# EasyEDA Pro project ProPrj_nrf52833_LighthouseTag_2025-07-23.epro

# Schematic Schematic4
Create Date: 2025-05-14; Page Name: P1; Project Name: Magnetic robot_hkust_bi; Schematic Name: Schematic4; Update Date: 2025-05-18
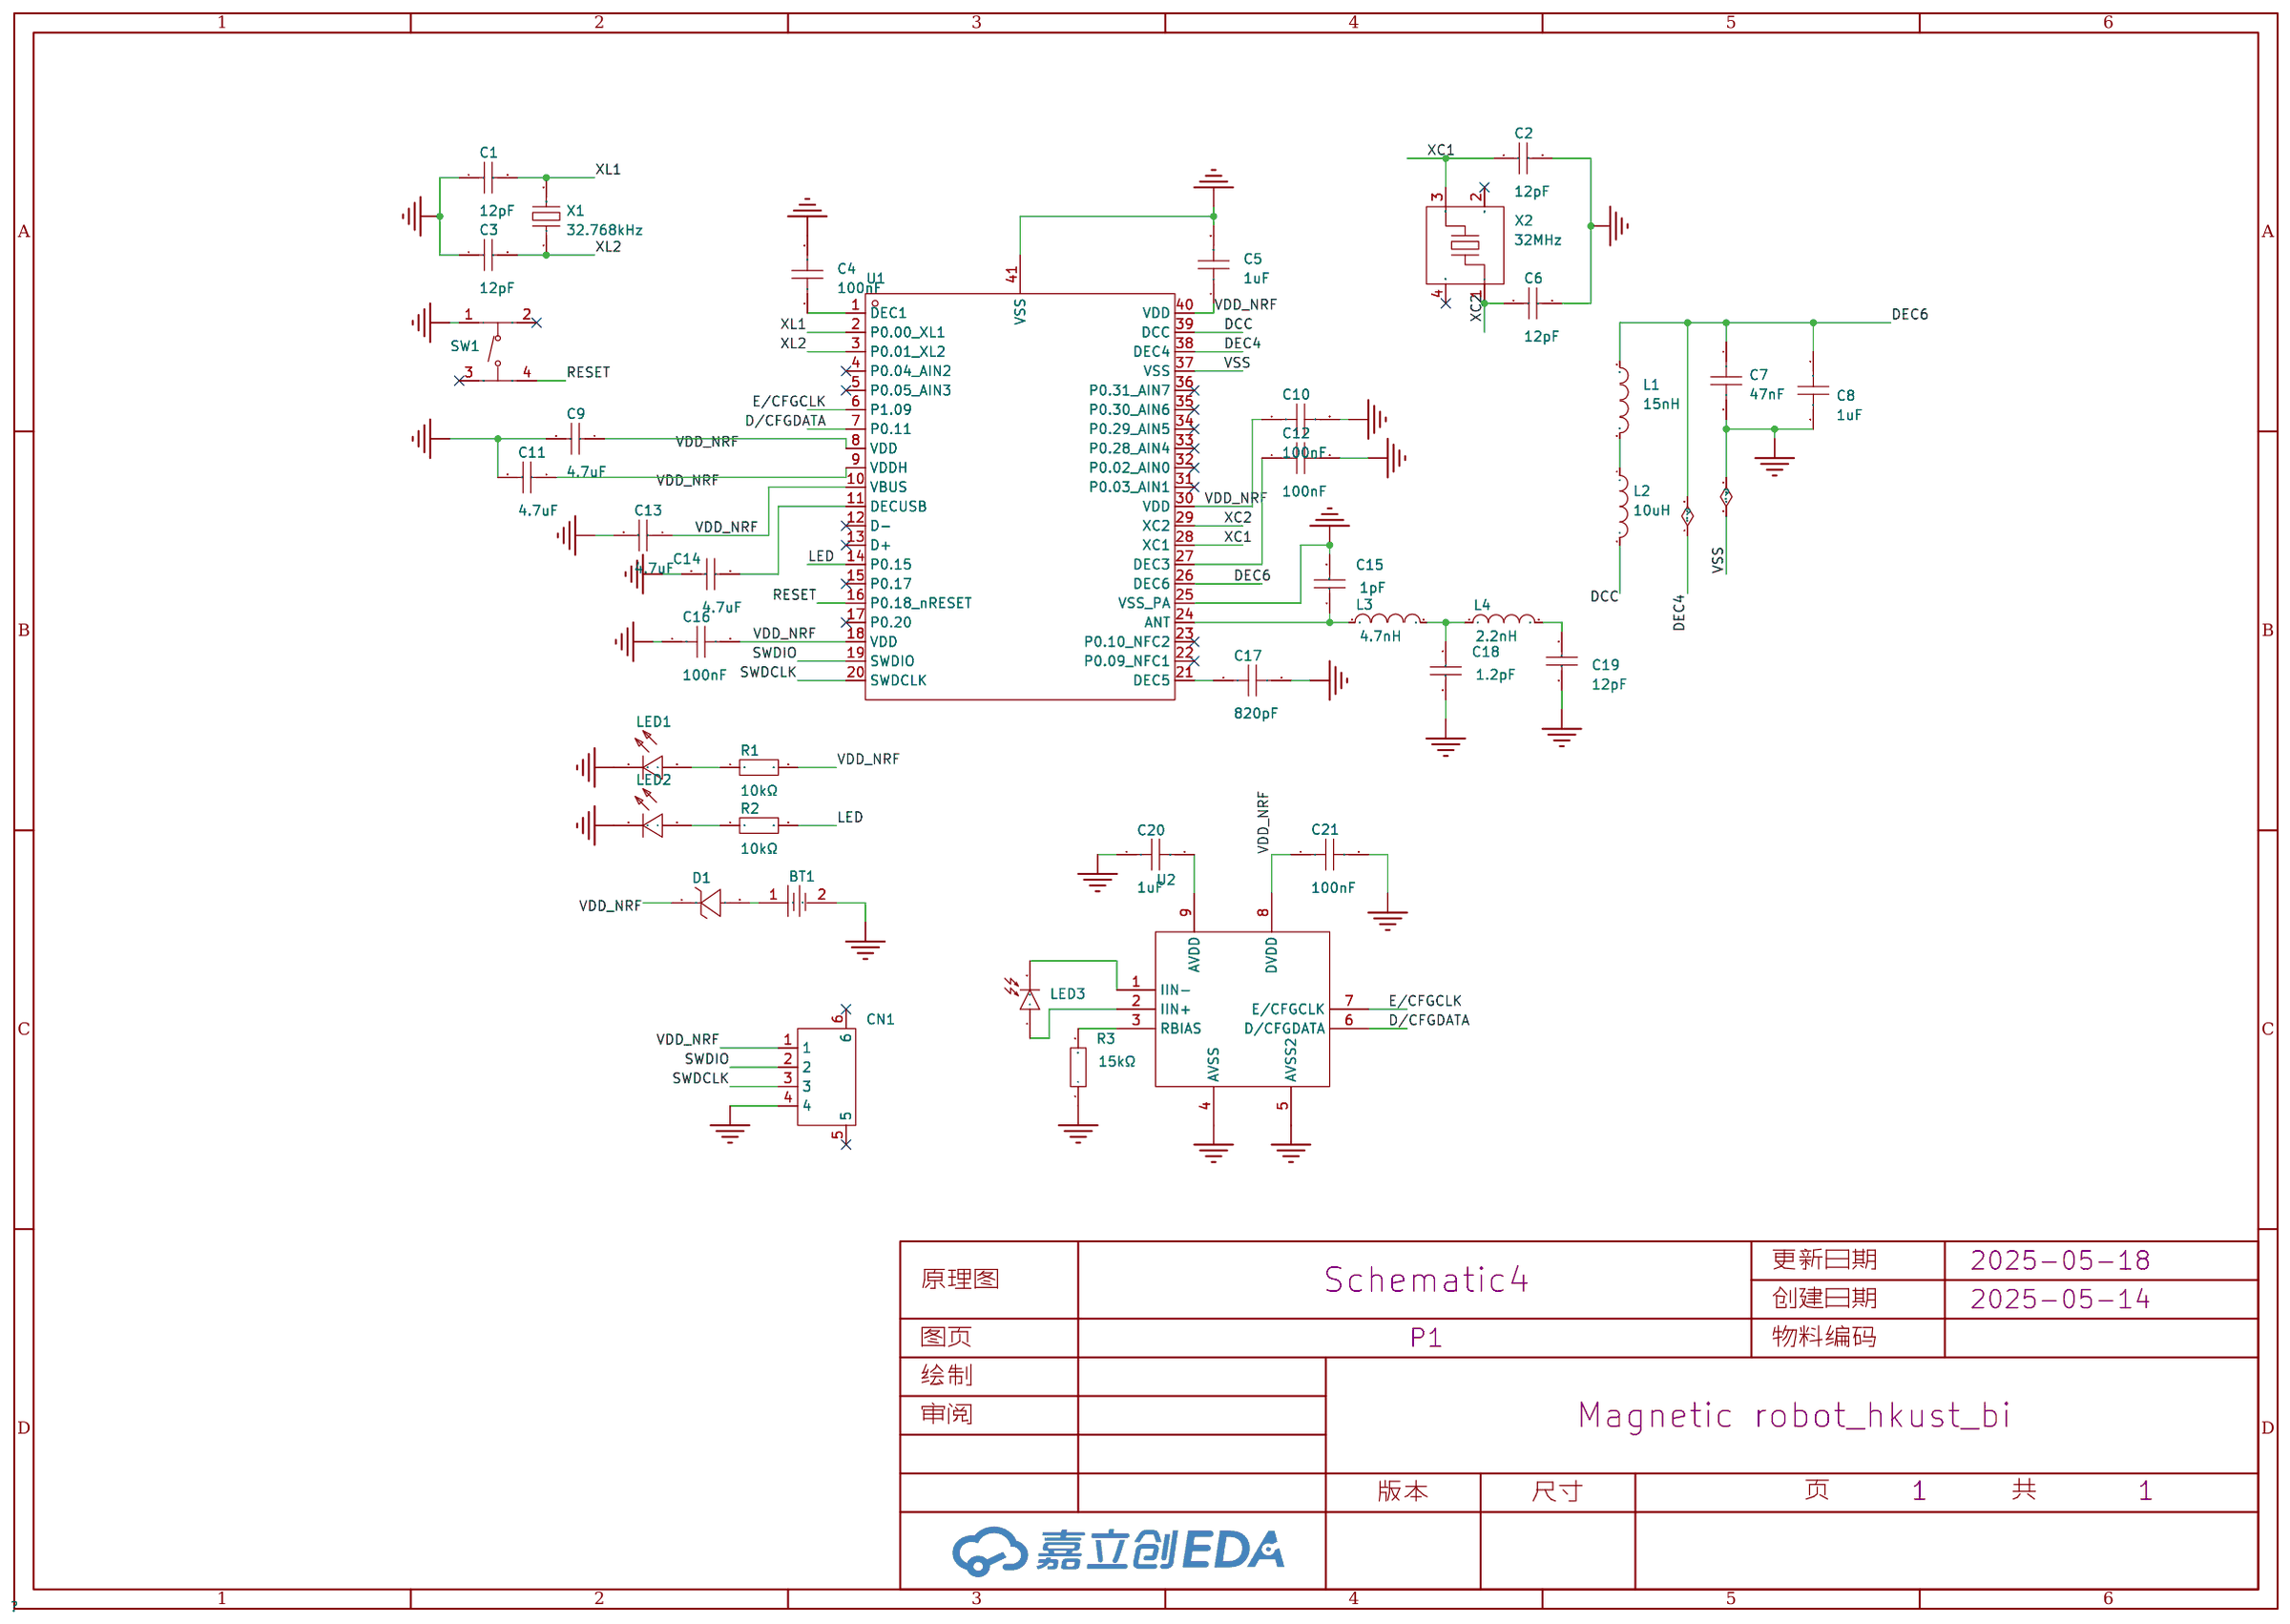
[diagram p0: schematic sheet]

## Parts
BT1  MY-927-01  [BAT-TH_MY-927-01]
C1  12pF  [C0402]
C2  12pF  [C0402]
C3  12pF  [C0402]
C4  100nF  [C0402]
C5  1uF  [C0402]
C6  12pF  [C0402]
C7  47nF  [C0402]
C8  1uF  [C0402]
C9  4.7uF  [C0402]
C10  100nF  [C0402]
C11  4.7uF  [C0402]
C12  100nF  [C0402]
C13  4.7uF  [C0402]
C14  4.7uF  [C0402]
C15  1pF  [C0402]
C16  100nF  [C0402]
C17  820pF  [C0402]
C18  1.2pF  [C0402]
C19  12pF  [C0402]
C20  1uF  [C0402]
C21  100nF  [C0402]
CN1  1.0-4PWB  [CONN-SMD_4P-P1.00_DEALON_1.0-4PWB]
D1  BZT52C3V3S  [SOD-323_L1.7-W1.3-LS2.6-RD]
L1  15nH  [IND-SMD_L1.0-W0.5-2]
L2  10uH  [IND-SMD_L2.5-W2.0]
L3  4.7nH  [IND-SMD_L1.0-W0.6]
L4  2.2nH  [IND-SMD_L1.0-W0.6]
LED1  NCD0603G1  [LED0603-RD_1]
LED2  NCD0603G1  [LED0603-RD_1]
LED3  VBPW34S  [SENSOR-SMD_L4.4-W3.9]
R1  10kΩ  [R0402]
R2  10kΩ  [R0402]
R3  15kΩ  [R0402]
SW1  TS-1187A-B-A-B  [SW-SMD_4P-L5.1-W5.1-P3.70-LS6.5-TL_H1.5]
U1  nRF52833-QDAA-R  [QFN-40_L5.0-W5.0-P0.40-TL-EP3.6]
U2  -  [TS4231]
X1  32.768kHz  [OSC-SMD_L3.2-W1.5]
X2  32MHz  [CRYSTAL-SMD_4P-L2.0-W1.6-BL-2]

## Library data of the parts
BT1 = MY-927-01: 连接器类型:电池扣;适用电池规格:CR927;触头材质:锰钢;触点电镀:镍;工作温度范围:-25~+85;; LCSC Part Name: 电池扣 适用电池:CR927; Supplier Part: C964850; Manufacturer: MYOUNG(美阳); Supplier Footprint: 插件; JLCPCB Part Class: Extended Part; Datasheet: https://atta.szlcsc.com/upload/public/pdf/source/20201218/C964850_48FDFDE1A9A12212C9EC07C1F9ECA79B.pdf; Supplier: LCSC; Connector Type: 电池扣; Battery Type: CR927; Contact Material: 锰钢; Contact Plating: 镍; Operating Temperature Range: -25~+85
C1-C3 C6 C19 = GRM1555C1H120JA01D: 容值:12pF;精度:±5%;额定电压:50V;温度系数:C0G;; LCSC Part Name: 12pF ±5% 50V; Supplier Part: C76948; Manufacturer: muRata(村田); Supplier Footprint: 0402; JLCPCB Part Class: Extended Part; Datasheet: https://atta.szlcsc.com/upload/public/pdf/source/20180307/C76948_15204091175261407736.pdf; Supplier: LCSC; Tolerance: ±5%; Voltage Rating: 50V; Temperature Coefficient: C0G
C4 C10 C12 C16 C21 = CL05B104KB54PNC: 容值:100nF;精度:±10%;额定电压:50V;材质(温度系数):X7R;; LCSC Part Name: 100nF ±10% 50V; Supplier Part: C307331; Manufacturer: SAMSUNG(三星); Supplier Footprint: 0402; JLCPCB Part Class: Basic Part; Datasheet: https://atta.szlcsc.com/upload/public/pdf/source/20160218/1457707763339.pdf; Supplier: LCSC; Tolerance: ±10%; Voltage Rated: 50V; Temperature Coefficient: X7R
C5 C8 C20 = CL05A105KA5NQNC: 容值:1uF;精度:±10%;额定电压:25V;材质(温度系数):X5R;; LCSC Part Name: 1uF ±10% 25V; Supplier Part: C52923; Manufacturer: SAMSUNG(三星); Supplier Footprint: 0402; JLCPCB Part Class: Basic Part; Datasheet: https://atta.szlcsc.com/upload/public/pdf/source/20160218/1457707763339.pdf; Supplier: LCSC; Tolerance: ±10%; Voltage Rated: 25V; Temperature Coefficient: X5R
C7 = CC0402KRX7R9BB473: 容值:47nF;精度:±10%;额定电压:50V;材质(温度系数):X7R;; LCSC Part Name: 47nF ±10% 50V; Supplier Part: C272875; Manufacturer: YAGEO(国巨); Supplier Footprint: 0402; JLCPCB Part Class: Extended Part; Datasheet: https://atta.szlcsc.com/upload/public/pdf/source/20181008/C309510_22F155564471FAF6A489F7D68F34234E.pdf; Supplier: LCSC; Tolerance: ±10%; Voltage Rated: 50V; Temperature Coefficient: X7R
C9 C11 C13 C14 = CL05A475MP5NRNC: 容值:4.7uF;精度:±20%;额定电压:10V;材质(温度系数):X5R;; LCSC Part Name: 4.7uF ±20% 10V; Supplier Part: C23733; Manufacturer: SAMSUNG(三星); Supplier Footprint: 0402; JLCPCB Part Class: Basic Part; Datasheet: https://atta.szlcsc.com/upload/public/pdf/source/20160218/1457707763339.pdf; Supplier: LCSC; Tolerance: ±20%; Voltage Rated: 10V; Temperature Coefficient: X5R
C15 = GJM1555C1H1R0WB01D: 容值:1pF;额定电压:50V;材质(温度系数):C0G;; LCSC Part Name: 1pF 50V ±0.05pF; Supplier Part: C72134; Manufacturer: muRata(村田); Supplier Footprint: 0402; JLCPCB Part Class: Extended Part; Datasheet: https://atta.szlcsc.com/upload/public/pdf/source/20161108/1478586454732.pdf; Supplier: LCSC; Voltage Rated: 50V; Temperature Coefficient: C0G
C17 = CC0402KRX7R9BB821: 容值:820pF;精度:±10%;额定电压:50V;材质(温度系数):X7R;; LCSC Part Name: 820pF ±10% 50V; Supplier Part: C107031; Manufacturer: YAGEO(国巨); Supplier Footprint: 0402; JLCPCB Part Class: Extended Part; Datasheet: https://atta.szlcsc.com/upload/public/pdf/source/20200803/C107031_D53C25CCCFEE93078DE0825CA32986C0.pdf; Supplier: LCSC; Tolerance: ±10%; Voltage Rated: 50V; Temperature Coefficient: X7R
C18 = GJM1555C1H1R2WB01D: 容值:1.2pF;额定电压:50V;材质(温度系数):C0G;; LCSC Part Name: 1.2pF 50V; Supplier Part: C76899; Manufacturer: muRata(村田); Supplier Footprint: 0402; JLCPCB Part Class: Extended Part; Datasheet: https://atta.szlcsc.com/upload/public/pdf/source/20180326/C76899_D46909C5BA6C0CCEF2691B3FE0C3732C.pdf; Supplier: LCSC; Voltage Rated: 50V; Temperature Coefficient: C0G
CN1 = 1.0-4PWB: 插针结构:1x4P;间距:1mm;安装方式:卧贴;参考系列:SH;总PIN数:4P;排数:1;每排PIN数:4;行距:-;额定电流:1A;触头材质:-;触头镀层:-;工作温度:-25~+85;; LCSC Part Name: 1x4P 间距:1mm 卧贴 系列:SH; Supplier Part: C2905006; Manufacturer: DEALON(德艺隆); Supplier Footprint: SMD,P=1mm,卧贴; JLCPCB Part Class: Extended Part; Datasheet: https://atta.szlcsc.com/upload/public/pdf/source/20211108/FAA45F8836A30651AE08A2D9A2D823F3.pdf; Supplier: LCSC; Pins Structure: 1x4P; Pitch: 1mm; Mounting Type: 卧贴; Reference Series: SH; Number of Pins: 4P; Number of Rows: 1; Number of PINs Per Row: 4; Current Rating: 1A; Operating Temperature: -25~+85; Voltage Rating: 50V; Supplementary Features: 辅助焊脚; Color: 米色; Z-Height of the Board: 2.9mm; X-Length of Bottom Edge on Board (Spacing Line): 6mm; Y-Width of Bottom Edge on Board: 5.03mm
D1 = BZT52C3V3S_C19077437: 二极管配置:独立式;稳压值(标称值):3.3V;稳压值(范围):3.1V~3.5V;功率(Pd):200mW;; Supplier Part: C19077437; Manufacturer: 宏迦橙; Supplier Footprint: SOD-323; JLCPCB Part Class: Extended Part; Datasheet: https://atta.szlcsc.com/upload/public/pdf/source/20231117/06CD1C2A69B3FFC97FEAE4263E1B2FE9.pdf; Supplier: LCSC; Diode Configuration: 独立式; Zener Voltage (Nom): 3.3V; Reverse Leakage Current (Ir): 5uA@1V; Zener Voltage (Range): 3.1V~3.5V; Power Dissipation: 200mW; Zener Impedance (Zzt): 95Ω
L1 = LQW15AN15NG00D: 电感值:15nH;精度:±2%;额定电流:460mA;饱和电流(Isat):-;; LCSC Part Name: 15nH ±2%; Supplier Part: C98055; Manufacturer: muRata(村田); Supplier Footprint: 0402; JLCPCB Part Class: Extended Part; Datasheet: https://atta.szlcsc.com/upload/public/pdf/source/20191016/C437364_463D6516B3BAE72B1DA0754F3D9B8308.pdf; Supplier: LCSC; Tolerance: ±2%; Rated Current: 460mA; DC Resistance (DCR): 160mΩ
L2 = FTC252012S100MBCA: 电感值:10uH;精度:±20%;额定电流:1.2A;饱和电流(Isat):1.6A;类型:一体成型电感;; LCSC Part Name: 10uH ±20% 1.6A; Supplier Part: C5832376; Manufacturer: cjiang(长江微电); Supplier Footprint: SMD,2x2.5mm; JLCPCB Part Class: Extended Part; Datasheet: https://atta.szlcsc.com/upload/public/pdf/source/20230602/8FFEDA9C0247A92A0D4B67554BFE4091.pdf; Supplier: LCSC; Tolerance: ±20%; Rated Current: 1.2A; Saturation Current (Isat): 1.6A; DC Resistance (DCR): 330mΩ; Type: 一体成型电感
L3 = LQW15AN4N7B00D: 电感值:4.7nH;额定电流:750mA;饱和电流(Isat):-;; Supplier Part: C98064; Manufacturer: muRata(村田); Supplier Footprint: 0402; JLCPCB Part Class: Extended Part; Datasheet: https://atta.szlcsc.com/upload/public/pdf/source/20191016/C437364_463D6516B3BAE72B1DA0754F3D9B8308.pdf; Supplier: LCSC; Rated Current: 750mA; DC Resistance (DCR): 70mΩ
L4 = LQW15AN2N2B80D: 电感值:2.2nH;额定电流:2.53A;饱和电流(Isat):-;; Supplier Part: C2041833; Manufacturer: muRata(村田); Supplier Footprint: 0402; JLCPCB Part Class: Extended Part; Datasheet: https://atta.szlcsc.com/upload/public/pdf/source/20210504/828CF85BF1F050871A8563B8C7472C90.pdf; Supplier: LCSC; Rated Current: 2.53A; DC Resistance (DCR): 22mΩ
LED1 LED2 = NCD0603G1: 发光颜色:翠绿色;正向压降(Vf):2.6V~3.6V;功率:72mW;正向电流:20mA;波长:515nm~530nm;透镜颜色:-;发光强度:330mcd~900mcd;发光角度:130°;工作温度:-30~+85;; Supplier Part: C84267; Manufacturer: 国星光电; Supplier Footprint: 0603; JLCPCB Part Class: Extended Part; Datasheet: https://atta.szlcsc.com/upload/public/pdf/source/20200820/C84267_04BA7703640BAC111D09F5EFB971FBF3.pdf; Supplier: LCSC; Illumination Color: 翠绿色; Voltage - Forward(Vf): 2.6V~3.6V; Power(Watts): 72mW; Forward Current: 20mA; Wavelength - Dominant: 515nm~530nm; Luminous Intensity: 330mcd~900mcd; Viewing Angle: 130°; Operating Temperature: -30~+85
LED3 = VBPW34S: 反向电压:60V;接收角:-;峰值波长:940nm;频谱范围:430nm~1100nm;暗电流:2nA;; LCSC Part Name: 940nm 频谱范围430nm~1100nm 反向电压60V; Supplier Part: C145262; Manufacturer: VISHAY(威世); Supplier Footprint: SMD,3.9x4.4mm; JLCPCB Part Class: Extended Part; Datasheet: https://atta.szlcsc.com/upload/public/pdf/source/20171211/C145262_15129614507721174601.pdf; Supplier: LCSC; DC Reverse Voltage: 60V; Peak  Wavelength: 940nm; Spectral Range: 430nm~1100nm; Current Dark: 2nA; Operating Temperature: -40~+100
R1 R2 = 0402WGF1002TCE: 电阻类型:厚膜电阻;阻值:10kΩ;精度:±1%;功率:62.5mW;最大工作电压:50V;温度系数:±100ppm/;; LCSC Part Name: 10kΩ ±1% 62.5mW 厚膜电阻; Supplier Part: C25744; Manufacturer: UNI-ROYAL(厚声); Supplier Footprint: 0402; JLCPCB Part Class: Basic Part; Datasheet: https://atta.szlcsc.com/upload/public/pdf/source/20200306/C422600_1E6D84923E4A46A82E41ADD87F860B5C.pdf; Supplier: LCSC; Type: 厚膜电阻; Tolerance: ±1%; Power(Watts): 62.5mW; Overload Voltage (Max): 50V; Temperature Coefficient: ±100ppm/; Operating Temperature Range: -55~+155
R3 = 0402WGF1502TCE: 电阻类型:厚膜电阻;阻值:15kΩ;精度:±1%;功率:62.5mW;最大工作电压:50V;温度系数:±100ppm/;; LCSC Part Name: 15kΩ ±1% 62.5mW 厚膜电阻; Supplier Part: C25756; Manufacturer: UNI-ROYAL(厚声); Supplier Footprint: 0402; JLCPCB Part Class: Basic Part; Datasheet: https://atta.szlcsc.com/upload/public/pdf/source/20200306/C422600_1E6D84923E4A46A82E41ADD87F860B5C.pdf; Supplier: LCSC; Type: 厚膜电阻; Tolerance: ±1%; Power(Watts): 62.5mW; Overload Voltage (Max): 50V; Temperature Coefficient: ±100ppm/; Operating Temperature Range: -55~+155
SW1 = TS-1187A-B-A-B: 电路结构:单刀单掷;按钮形状:圆形按钮;作用力:160gf;安装方式:立贴;开关长度:5.1mm;开关宽度:5.1mm;开关高度:1.5mm;带支架:不带;触点电流:50mA;额定电压(DC):12V;绝缘电阻:-;带灯:无;机械寿命:10万次;; LCSC Part Name: 5.1*5.1*1.5mm 立贴 轻触开关; Supplier Part: C318884; Manufacturer: XKB Connectivity(中国星坤); Supplier Footprint: SMD; JLCPCB Part Class: Basic Part; Datasheet: https://atta.szlcsc.com/upload/public/pdf/source/20200227/C318890_053E50208A88A7BA1965D8746000774E.pdf; Supplier: LCSC; Circuit: 单刀单掷; Actuator Style: 圆形按钮; Operating Force: 160gf; Mounting Style: 立贴; Switch Length: 5.1mm; Switch Width: 5.1mm; Switch Height: 1.5mm; Strike Gundam: 不带; Contact Current: 50mA; Voltage Rating (DC): 12V; Actuator/Cap Color: 金色; With Lamp: 无; Mechanical Life: 10万次; Operating Temperature: -30~+85
U1 = nRF52833-QDAA-R: Supplier Part: C2895249; Manufacturer: NORDIC; Supplier Footprint: QFN-40-EP(5x5); JLCPCB Part Class: Extended Part; Datasheet: https://atta.szlcsc.com/upload/public/pdf/source/20220526/66538D94E2BF566AD23AAE4CF6584247.pdf; Supplier: LCSC
U2 = TS4231
X1 = X321532768KGD2SI: 晶振类型:贴片晶振;频率:32.768kHz;常温频差:±20ppm;外接负载电容:12.5pF;频率稳定度(全温):-;; LCSC Part Name: 32.768kHz ±20ppm 12.5pF; Supplier Part: C620155; Manufacturer: YXC(扬兴晶振); Supplier Footprint: SMD3215-2P; JLCPCB Part Class: Extended Part; Datasheet: https://atta.szlcsc.com/upload/public/pdf/source/20240329/3A7650FD985DD0DE85694D3785AB4916.pdf; Supplier: LCSC; Crystal Type: 贴片晶振; Normal temperature Frequency Tolerance: ±20ppm; External load capacitor: 12.5pF; Operating Temperature: -40~+85
X2 = X201632MOB4SI: 晶振类型:贴片晶振;频率:32MHz;常温频差:±10ppm;负载电容:12pF;频率稳定度:±20ppm;; LCSC Part Name: 32MHz ±10ppm 12pF; Supplier Part: C2682773; Manufacturer: YXC(扬兴晶振); Supplier Footprint: SMD2016-4P; JLCPCB Part Class: Extended Part; Datasheet: https://atta.szlcsc.com/upload/public/pdf/source/20240329/C26C9A15A73CBCFBF373B30A8E126750.pdf; Supplier: LCSC; Type: 贴片晶振; Normal temperature Frequency Tolerance: ±10ppm; Load Capacitance: 12pF; Frequency Stability: ±20ppm; Operating Temperature: -40~+85

## Nets
GND: BT1.2 C1.1 C2.2 C3.1 C4.2 C5.2 C6.2 C7.2 C8.2 C9.2 C10.2 C11.2 C12.2 C13.2 C14.1 C15.2 C16.1 C17.2 C18.1 C19.1 C20.1 C21.2 CN1.4 LED1.1(K) LED2.1(K) R3.1 SW1.1(A) U1.25(VSS_PA) U1.37(VSS) U1.41(VSS) U2.4(AVSS) U2.5(AVSS2)
VDD_NRF: C5.1 C9.1 C10.1 C11.1 C13.1 C16.2 C21.1 CN1.1 D1.1(K) R1.2 U1.8(VDD) U1.9(VDDH) U1.10(VBUS) U1.18(VDD) U1.30(VDD) U1.40(VDD) U2.8(DVDD)
D/CFGDATA: U1.7(P0.11) U2.6(D/CFGDATA)
DCC: L2.2 U1.39(DCC)
DEC4: C7.1 C8.1 L1.2 U1.26(DEC6) U1.38(DEC4)
E/CFGCLK: U1.6(P1.09) U2.7(E/CFGCLK)
LED: R2.2 U1.14(P0.15)
RESET: SW1.4(D) U1.16(P0.18_nRESET)
SWDCLK: CN1.3 U1.20(SWDCLK)
SWDIO: CN1.2 U1.19(SWDIO)
XC1: C2.1 U1.28(XC1) X2.3
XC2: C6.1 U1.29(XC2) X2.1
XL1: C1.2 U1.2(P0.00_XL1) X1.2
XL2: C3.2 U1.3(P0.01_XL2) X1.1
$1N1552: C14.2 U1.11(DECUSB)
$1N2289: C17.1 U1.21(DEC5)
$1N2530: C15.1 L3.1 U1.24(ANT)
$1N2985: C18.2 L3.2 L4.1
$1N3242: C19.2 L4.2
$1N3495: C12.1 U1.27(DEC3)
$1N6091: L1.1 L2.1
$1N9430: C20.2 U2.9(AVDD)
$1N11204: LED3.2(C) U2.1(IIN-)
$1N11226: LED3.1(A) U2.2(IIN+)
$1N11357: R3.2 U2.3(RBIAS)
$1N20837: BT1.1 D1.2(A)
$1N22902: LED2.2(A) R2.1
$1N23087: C4.1 U1.1(DEC1)
$1N23686: LED1.2(A) R1.1

Not connected (* = marked no-connect by the designer): CN1 5* 6*; SW1 2(B)* 3(C)*; U1 4(P0.04_AIN2)* 5(P0.05_AIN3)* 12(D-)* 13(D+)* 15(P0.17)* 17(P0.20)* 22(P0.09_NFC1)* 23(P0.10_NFC2)* 31(P0.03_AIN1)* 32(P0.02_AIN0)* 33(P0.28_AIN4)* 34(P0.29_AIN5)* 35(P0.30_AIN6)* 36(P0.31_AIN7)*; X2 2(GND)* 4(GND)*

# Schematic Schematic4_1
Board Name: Positioning tag; Create Date: 2025-06-04; Page Name: P1; Project Name: Magnetic robot_hkust_bi; Schematic Name: Schematic4; Update Date: 2025-07-18; Company: 嘉立创EDA; Page Size: A4; Version: V1.0
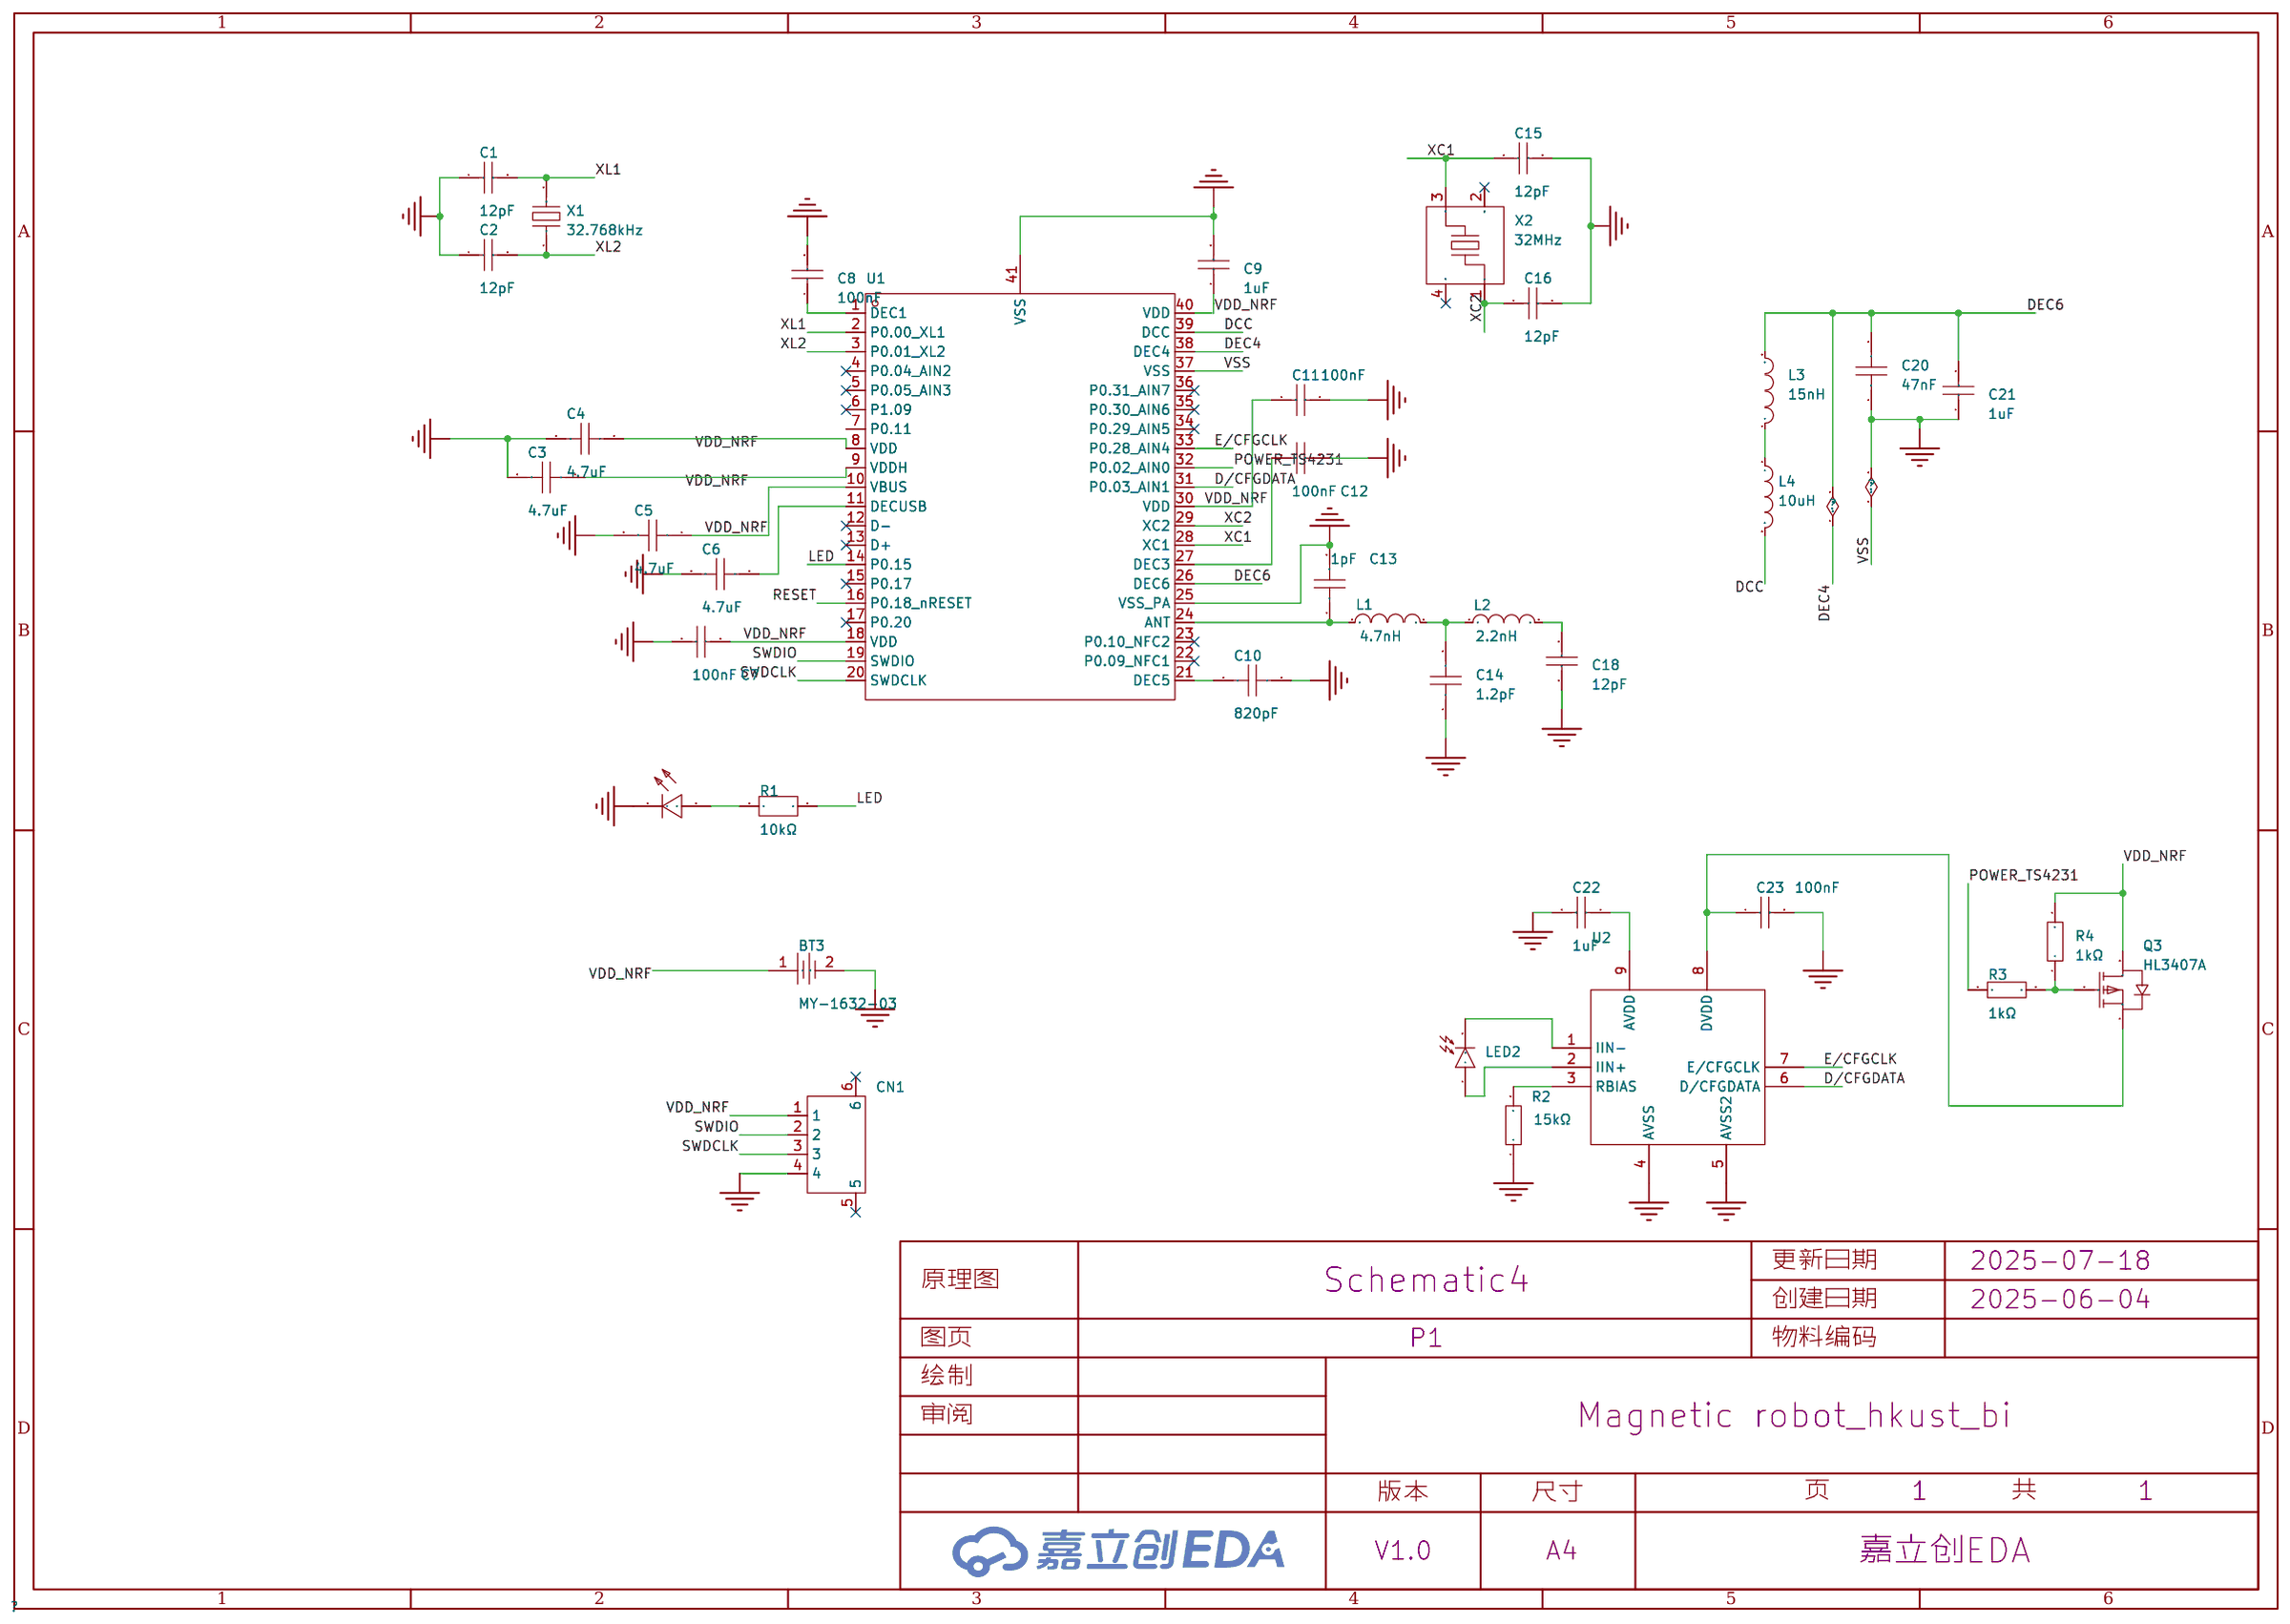
[diagram p1: schematic sheet]

## Parts
BT3  MY-1632-03  [BAT-SMD_MY-1632-03]
C1  12pF  [C0402]
C2  12pF  [C0402]
C3  4.7uF  [C0201]
C4  4.7uF  [C0201]
C5  4.7uF  [C0201]
C6  4.7uF  [C0201]
C7  100nF  [C0201]
C8  100nF  [C0201]
C9  1uF  [C0201]
C10  820pF  [C0402]
C11  100nF  [C0201]
C12  100nF  [C0201]
C13  1pF  [C0201]
C14  1.2pF  [C0201]
C15  12pF  [C0402]
C16  12pF  [C0402]
C18  12pF  [C0402]
C20  47nF  [C0201]
C21  1uF  [C0201]
C22  1uF  [C0201]
C23  100nF  [C0201]
CN1  1.0-4PWB  [CONN-SMD_4P-P1.00_DEALON_1.0-4PWB]
L1  4.7nH  [IND-SMD_L1.0-W0.6]
L2  2.2nH  [IND-SMD_L1.0-W0.6]
L3  15nH  [IND-SMD_L1.0-W0.5-2]
L4  10uH  [IND-SMD_L2.5-W2.0]
LED1  NCD0603G1  [LED0603-RD_1]
LED2  VBPW34S  [SENSOR-SMD_L4.4-W3.9]
Q3  HL3407A  [SOT-23-3_L2.9-W1.3-P1.90-LS2.4-BL-1]
R1  10kΩ  [R0201]
R2  15kΩ  [R0402]
R3  1kΩ  [R0201]
R4  1kΩ  [R0201]
U1  nRF52833-QDAA-R  [QFN-40_L5.0-W5.0-P0.40-TL-EP3.6]
U2  -  [TS4231]
X1  32.768kHz  [OSC-SMD_L3.2-W1.5]
X2  32MHz  [CRYSTAL-SMD_4P-L2.0-W1.6-BL-2]

## Library data of the parts
BT3 = MY-1632-03: 连接器类型:电池扣;适用电池规格:CR1632;触头材质:磷青铜;触点电镀:镍;工作温度范围:-;; LCSC Part Name: 电池扣 适用电池:CR1632; Supplier Part: C2902337; Manufacturer: MYOUNG(美阳); Supplier Footprint: SMD; JLCPCB Part Class: 扩展库; Datasheet: https://atta.szlcsc.com/upload/public/pdf/source/20210930/472CF4FBD9839664A13EAEB041674A4D.pdf; Supplier: LCSC; Connector Type: 电池扣; Battery Type: CR1632; Contact Material: 磷青铜; Contact Plating: 镍
C1 C2 C15 C16 C18 = GRM1555C1H120JA01D: 容值:12pF;精度:±5%;额定电压:50V;温度系数:C0G;; LCSC Part Name: 12pF ±5% 50V; Supplier Part: C76948; Manufacturer: muRata(村田); Supplier Footprint: 0402; JLCPCB Part Class: Extended Part; Datasheet: https://atta.szlcsc.com/upload/public/pdf/source/20180307/C76948_15204091175261407736.pdf; Supplier: LCSC; Tolerance: ±5%; Voltage Rating: 50V; Temperature Coefficient: C0G
C3-C6 = GRM035R60J475ME15D: 容值:4.7uF;精度:±20%;额定电压:6.3V;温度系数:X5R;; LCSC Part Name: 4.7uF ±20% 6.3V; Supplier Part: C335103; Manufacturer: muRata(村田); Supplier Footprint: 0201; JLCPCB Part Class: 扩展库; Datasheet: https://atta.szlcsc.com/upload/public/pdf/source/20200305/C490387_23319AE8C154DEB24C505E6C82A8106A.pdf; Supplier: LCSC; Tolerance: ±20%; Voltage Rating: 6.3V; Temperature Coefficient: X5R
C7 C8 C11 C12 C23 = GRM033R61E104KE14D: 容值:100nF;精度:±10%;额定电压:25V;温度系数:X5R;; LCSC Part Name: 100nF ±10% 25V; Supplier Part: C76939; Manufacturer: muRata(村田); Supplier Footprint: 0201; JLCPCB Part Class: 扩展库; Datasheet: https://atta.szlcsc.com/upload/public/pdf/source/20180307/C76939_15204091018551407727.pdf; Supplier: LCSC; Tolerance: ±10%; Voltage Rating: 25V; Temperature Coefficient: X5R
C9 C21 C22 = GRM033R61A105ME44D: 容值:1uF;精度:±20%;额定电压:10V;材质(温度系数):X5R;; LCSC Part Name: 1uF ±20% 10V; Supplier Part: C76935; Manufacturer: muRata(村田); Supplier Footprint: 0201; JLCPCB Part Class: 扩展库; Datasheet: https://atta.szlcsc.com/upload/public/pdf/source/20190904/C426118_85E81C7C1F21FC87C5FB6D536E0847B4.pdf; Supplier: LCSC; Tolerance: ±20%; Voltage Rated: 10V; Temperature Coefficient: X5R
C10 = CC0402KRX7R9BB821: 容值:820pF;精度:±10%;额定电压:50V;材质(温度系数):X7R;; LCSC Part Name: 820pF ±10% 50V; Supplier Part: C107031; Manufacturer: YAGEO(国巨); Supplier Footprint: 0402; JLCPCB Part Class: Extended Part; Datasheet: https://atta.szlcsc.com/upload/public/pdf/source/20200803/C107031_D53C25CCCFEE93078DE0825CA32986C0.pdf; Supplier: LCSC; Tolerance: ±10%; Voltage Rated: 50V; Temperature Coefficient: X7R
C13 = GRM0335C1H1R0BA01D: 容值:1pF;精度:-;额定电压:50V;温度系数:C0G;; LCSC Part Name: ±0.1pF 1pF 50V; Supplier Part: C85893; Manufacturer: muRata(村田); Supplier Footprint: 0201; JLCPCB Part Class: 扩展库; Datasheet: https://atta.szlcsc.com/upload/public/pdf/source/20200305/C490387_23319AE8C154DEB24C505E6C82A8106A.pdf; Supplier: LCSC; Voltage Rating: 50V; Temperature Coefficient: C0G
C14 = GRM0335C1H1R2BA01D: 容值:1.2pF;额定电压:50V;材质(温度系数):C0G;; LCSC Part Name: 1.2pF 50V; Supplier Part: C85895; Manufacturer: muRata(村田); Supplier Footprint: 0201; JLCPCB Part Class: 扩展库; Datasheet: https://atta.szlcsc.com/upload/public/pdf/source/20200305/C490387_23319AE8C154DEB24C505E6C82A8106A.pdf; Supplier: LCSC; Voltage Rated: 50V; Temperature Coefficient: C0G
C20 = CGA0201X5R473K160ET: 容值:47nF;精度:±10%;额定电压:16V;温度系数:X5R;; LCSC Part Name: 47nF ±10% 16V; Supplier Part: C45359887; Manufacturer: HRE(芯声); Supplier Footprint: 0201; JLCPCB Part Class: 扩展库; Datasheet: https://atta.szlcsc.com/upload/public/pdf/source/20250220/29719F0DB54B0A066ED9CF136703C3DF.pdf; Supplier: LCSC; Tolerance: ±10%; Voltage Rating: 16V; Temperature Coefficient: X5R
CN1 = 1.0-4PWB: 插针结构:1x4P;间距:1mm;安装方式:卧贴;参考系列:SH;总PIN数:4P;排数:1;每排PIN数:4;行距:-;额定电流:1A;触头材质:-;触头镀层:-;工作温度:-25~+85;; LCSC Part Name: 1x4P 间距:1mm 卧贴 系列:SH; Supplier Part: C2905006; Manufacturer: DEALON(德艺隆); Supplier Footprint: SMD,P=1mm,卧贴; JLCPCB Part Class: Extended Part; Datasheet: https://atta.szlcsc.com/upload/public/pdf/source/20211108/FAA45F8836A30651AE08A2D9A2D823F3.pdf; Supplier: LCSC; Pins Structure: 1x4P; Pitch: 1mm; Mounting Type: 卧贴; Reference Series: SH; Number of Pins: 4P; Number of Rows: 1; Number of PINs Per Row: 4; Current Rating: 1A; Operating Temperature: -25~+85; Voltage Rating: 50V; Supplementary Features: 辅助焊脚; Color: 米色; Z-Height of the Board: 2.9mm; X-Length of Bottom Edge on Board (Spacing Line): 6mm; Y-Width of Bottom Edge on Board: 5.03mm
L1 = LQW15AN4N7B00D: 电感值:4.7nH;额定电流:750mA;饱和电流(Isat):-;; Supplier Part: C98064; Manufacturer: muRata(村田); Supplier Footprint: 0402; JLCPCB Part Class: Extended Part; Datasheet: https://atta.szlcsc.com/upload/public/pdf/source/20191016/C437364_463D6516B3BAE72B1DA0754F3D9B8308.pdf; Supplier: LCSC; Rated Current: 750mA; DC Resistance (DCR): 70mΩ
L2 = LQW15AN2N2B80D: 电感值:2.2nH;额定电流:2.53A;饱和电流(Isat):-;; Supplier Part: C2041833; Manufacturer: muRata(村田); Supplier Footprint: 0402; JLCPCB Part Class: Extended Part; Datasheet: https://atta.szlcsc.com/upload/public/pdf/source/20210504/828CF85BF1F050871A8563B8C7472C90.pdf; Supplier: LCSC; Rated Current: 2.53A; DC Resistance (DCR): 22mΩ
L3 = LQW15AN15NG00D: 电感值:15nH;精度:±2%;额定电流:460mA;饱和电流(Isat):-;; LCSC Part Name: 15nH ±2%; Supplier Part: C98055; Manufacturer: muRata(村田); Supplier Footprint: 0402; JLCPCB Part Class: Extended Part; Datasheet: https://atta.szlcsc.com/upload/public/pdf/source/20191016/C437364_463D6516B3BAE72B1DA0754F3D9B8308.pdf; Supplier: LCSC; Tolerance: ±2%; Rated Current: 460mA; DC Resistance (DCR): 160mΩ
L4 = FTC252012S100MBCA: 电感值:10uH;精度:±20%;额定电流:1.2A;饱和电流(Isat):1.6A;类型:一体成型电感;; LCSC Part Name: 10uH ±20% 1.6A; Supplier Part: C5832376; Manufacturer: cjiang(长江微电); Supplier Footprint: SMD,2x2.5mm; JLCPCB Part Class: Extended Part; Datasheet: https://atta.szlcsc.com/upload/public/pdf/source/20230602/8FFEDA9C0247A92A0D4B67554BFE4091.pdf; Supplier: LCSC; Tolerance: ±20%; Rated Current: 1.2A; Saturation Current (Isat): 1.6A; DC Resistance (DCR): 330mΩ; Type: 一体成型电感
LED1 = NCD0603G1: 发光颜色:翠绿色;正向压降(Vf):2.6V~3.6V;功率:72mW;正向电流:20mA;波长:515nm~530nm;透镜颜色:-;发光强度:330mcd~900mcd;发光角度:130°;工作温度:-30~+85;; Supplier Part: C84267; Manufacturer: 国星光电; Supplier Footprint: 0603; JLCPCB Part Class: Extended Part; Datasheet: https://atta.szlcsc.com/upload/public/pdf/source/20200820/C84267_04BA7703640BAC111D09F5EFB971FBF3.pdf; Supplier: LCSC; Illumination Color: 翠绿色; Voltage - Forward(Vf): 2.6V~3.6V; Power(Watts): 72mW; Forward Current: 20mA; Wavelength - Dominant: 515nm~530nm; Luminous Intensity: 330mcd~900mcd; Viewing Angle: 130°; Operating Temperature: -30~+85
LED2 = VBPW34S: 反向电压:60V;接收角:-;峰值波长:940nm;频谱范围:430nm~1100nm;暗电流:2nA;; LCSC Part Name: 940nm 频谱范围430nm~1100nm 反向电压60V; Supplier Part: C145262; Manufacturer: VISHAY(威世); Supplier Footprint: SMD,3.9x4.4mm; JLCPCB Part Class: Extended Part; Datasheet: https://atta.szlcsc.com/upload/public/pdf/source/20171211/C145262_15129614507721174601.pdf; Supplier: LCSC; DC Reverse Voltage: 60V; Peak  Wavelength: 940nm; Spectral Range: 430nm~1100nm; Current Dark: 2nA; Operating Temperature: -40~+100
Q3 = HL3407A: 数量:-;漏源电压(Vdss):30V;连续漏极电流(Id):4.1A;导通电阻(RDS(on)):68mΩ@4.5V;耗散功率(Pd):1.2W;阈值电压(Vgs(th)):2.4V@250uA;; LCSC Part Name: P沟道,电流:-4.1A,耐压:-30V; Supplier Part: C28646269; Manufacturer: 宏嘉诚; Supplier Footprint: SOT-23; JLCPCB Part Class: 扩展库; Datasheet: https://atta.szlcsc.com/upload/public/pdf/source/20250627/C6644FDB2DD0D7F1420F626AF38A96D7.pdf; Supplier: LCSC; Drain to Source Voltage: 30V; Current - Continuous Drain(Id): 4.1A; RDS(on): 68mΩ@4.5V; Pd - Power Dissipation: 1.2W; Gate Threshold Voltage (Vgs(th)@Id): 2.4V@250uA; Gate Charge(Qg): 12nC@10V; Input Capacitance(Ciss): 572pF; Reverse Transfer Capacitance (Crss@Vds): 70pF@15V; Operating Temperature: -55℃~+150℃
R1 = 0201WMF1002TEE: 电阻类型:厚膜电阻;阻值:10kΩ;精度:±1%;功率:50mW;最大工作电压:25V;温度系数:±200ppm/℃;; LCSC Part Name: 10kΩ ±1% 50mW 厚膜电阻; Supplier Part: C473048; Manufacturer: UNI-ROYAL(厚声); Supplier Footprint: 0201; JLCPCB Part Class: 扩展库; Datasheet: https://atta.szlcsc.com/upload/public/pdf/source/20200306/C422600_1E6D84923E4A46A82E41ADD87F860B5C.pdf; Supplier: LCSC; Type: 厚膜电阻; Tolerance: ±1%; Power(Watts): 50mW; Overload Voltage (Max): 25V; Temperature Coefficient: ±200ppm/℃; Operating Temperature Range: -55℃~+155℃
R2 = 0402WGF1502TCE: 电阻类型:厚膜电阻;阻值:15kΩ;精度:±1%;功率:62.5mW;最大工作电压:50V;温度系数:±100ppm/;; LCSC Part Name: 15kΩ ±1% 62.5mW 厚膜电阻; Supplier Part: C25756; Manufacturer: UNI-ROYAL(厚声); Supplier Footprint: 0402; JLCPCB Part Class: Basic Part; Datasheet: https://atta.szlcsc.com/upload/public/pdf/source/20200306/C422600_1E6D84923E4A46A82E41ADD87F860B5C.pdf; Supplier: LCSC; Type: 厚膜电阻; Tolerance: ±1%; Power(Watts): 62.5mW; Overload Voltage (Max): 50V; Temperature Coefficient: ±100ppm/; Operating Temperature Range: -55~+155
R3 R4 = 0201WMF1001TEE: 电阻类型:厚膜电阻;阻值:1kΩ;精度:±1%;功率:50mW;最大工作电压:25V;温度系数:±200ppm/℃;; LCSC Part Name: 1kΩ ±1% 50mW 厚膜电阻; Supplier Part: C270365; Manufacturer: UNI-ROYAL(厚声); Supplier Footprint: 0201; JLCPCB Part Class: 扩展库; Datasheet: https://atta.szlcsc.com/upload/public/pdf/source/20200306/C422600_1E6D84923E4A46A82E41ADD87F860B5C.pdf; Supplier: LCSC; Type: 厚膜电阻; Tolerance: ±1%; Power(Watts): 50mW; Overload Voltage (Max): 25V; Temperature Coefficient: ±200ppm/℃; Operating Temperature Range: -55℃~+155℃
U1 = nRF52833-QDAA-R: Supplier Part: C2895249; Manufacturer: NORDIC; Supplier Footprint: QFN-40-EP(5x5); JLCPCB Part Class: Extended Part; Datasheet: https://atta.szlcsc.com/upload/public/pdf/source/20220526/66538D94E2BF566AD23AAE4CF6584247.pdf; Supplier: LCSC
U2 = TS4231
X1 = X321532768KGD2SI: 晶振类型:贴片晶振;频率:32.768kHz;常温频差:±20ppm;外接负载电容:12.5pF;频率稳定度(全温):-;; LCSC Part Name: 32.768kHz ±20ppm 12.5pF; Supplier Part: C620155; Manufacturer: YXC(扬兴晶振); Supplier Footprint: SMD3215-2P; JLCPCB Part Class: Extended Part; Datasheet: https://atta.szlcsc.com/upload/public/pdf/source/20240329/3A7650FD985DD0DE85694D3785AB4916.pdf; Supplier: LCSC; Crystal Type: 贴片晶振; Normal temperature Frequency Tolerance: ±20ppm; External load capacitor: 12.5pF; Operating Temperature: -40~+85
X2 = X201632MOB4SI: 晶振类型:贴片晶振;频率:32MHz;常温频差:±10ppm;负载电容:12pF;频率稳定度:±20ppm;; LCSC Part Name: 32MHz ±10ppm 12pF; Supplier Part: C2682773; Manufacturer: YXC(扬兴晶振); Supplier Footprint: SMD2016-4P; JLCPCB Part Class: Extended Part; Datasheet: https://atta.szlcsc.com/upload/public/pdf/source/20240329/C26C9A15A73CBCFBF373B30A8E126750.pdf; Supplier: LCSC; Type: 贴片晶振; Normal temperature Frequency Tolerance: ±10ppm; Load Capacitance: 12pF; Frequency Stability: ±20ppm; Operating Temperature: -40~+85

## Nets
GND: BT3.2 C1.1 C2.1 C3.2 C4.2 C5.2 C6.2 C7.1 C8.2 C9.2 C10.2 C11.2 C12.2 C13.2 C14.1 C15.2 C16.2 C18.1 C20.1 C21.1 C22.2 C23.2 CN1.4 LED1.1(K) R2.1 U1.25(VSS_PA) U1.37(VSS) U1.41(VSS) U2.4(AVSS) U2.5(AVSS2)
VDD_NRF: BT3.1 C3.1 C4.1 C5.1 C7.2 C9.1 C11.1 CN1.1 Q3.3(D) R4.2 U1.8(VDD) U1.9(VDDH) U1.10(VBUS) U1.18(VDD) U1.30(VDD) U1.40(VDD)
D/CFGDATA: U1.31(P0.03_AIN1) U2.6(D/CFGDATA)
DCC: L4.2 U1.39(DCC)
DEC4: C20.2 C21.2 L3.2 U1.26(DEC6) U1.38(DEC4)
E/CFGCLK: U1.33(P0.28_AIN4) U2.7(E/CFGCLK)
LED: R1.1 U1.14(P0.15)
POWER_TS4231: R3.1 U1.32(P0.02_AIN0)
RESET: U1.16(P0.18_nRESET)
SWDCLK: CN1.3 U1.20(SWDCLK)
SWDIO: CN1.2 U1.19(SWDIO)
XC1: C15.1 U1.28(XC1) X2.3
XC2: C16.1 U1.29(XC2) X2.1
XL1: C1.2 U1.2(P0.00_XL1) X1.2
XL2: C2.2 U1.3(P0.01_XL2) X1.1
$1N2289: C10.1 U1.21(DEC5)
$1N2530: C13.1 L1.1 U1.24(ANT)
$1N2985: C14.2 L1.2 L2.1
$1N3242: C18.2 L2.2
$1N3495: C12.1 U1.27(DEC3)
$1N6091: L3.1 L4.1
$1N9430: C22.1 U2.9(AVDD)
$1N11204: LED2.2(C) U2.1(IIN-)
$1N11226: LED2.1(A) U2.2(IIN+)
$1N11357: R2.2 U2.3(RBIAS)
$1N22902: LED1.2(A) R1.2
$1N23087: C8.1 U1.1(DEC1)
$1N28962: C23.1 Q3.2(S) U2.8(DVDD)
$1N29852: C6.1 U1.11(DECUSB)
$1N31595: Q3.1(G) R3.2 R4.1

Not connected (* = marked no-connect by the designer): CN1 5* 6*; U1 4(P0.04_AIN2)* 5(P0.05_AIN3)* 6(P1.09)* 7(P0.11) 12(D-)* 13(D+)* 15(P0.17)* 17(P0.20)* 22(P0.09_NFC1)* 23(P0.10_NFC2)* 34(P0.29_AIN5)* 35(P0.30_AIN6)* 36(P0.31_AIN7)*; X2 2(GND)* 4(GND)*

# Board PCB18
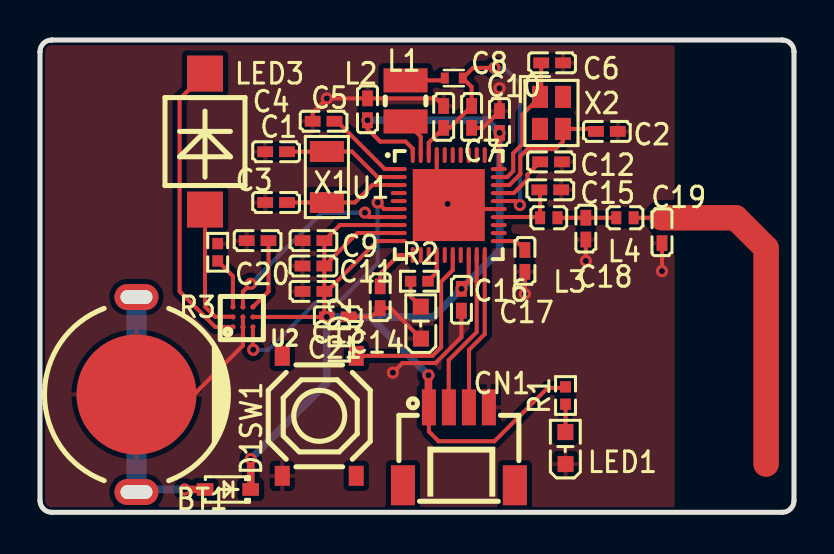
[diagram p2: board, top side]
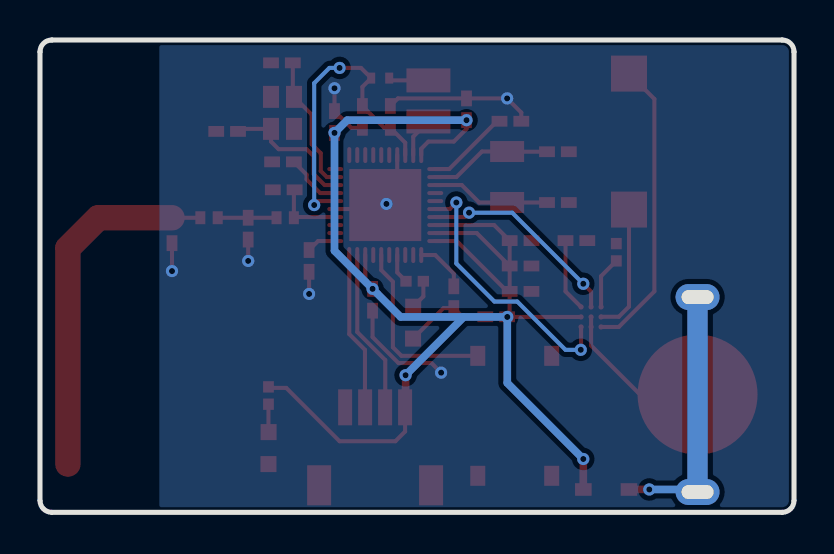
[diagram p3: board, bottom side, seen from below]

Outline 37.72 x 23.62 mm; copper layers: Top Layer, Bottom Layer. Coordinates in mm from the lower left corner of the outline.
Outline path: 0,23.03 0,0.59 arc(0.17,0.17) 0.59,0 37.13,0 arc(37.55,0.17) 37.72,0.59 37.72,23.03 arc(37.55,23.45) 37.13,23.62 0.59,23.62 arc(0.17,23.45) 0,23.03
Stack: Top Layer 0.035mm / Dielectric1 1.51mm FR4 er 4.5 / Bottom Layer 0.035mm

## Design rules (mm)
spacing safeClearance (default): track to track 0.152, other pairs 0.152 to 0.3
track width trackWidth (default): min 0.127, default 0.203, max 2.54
differential pair differentialPair (default): width min 0.127, default 0.254, max 2.54; gap min 0.152, default 0.152
via viaSize (default): diameter min 0.5, default 0.61, max 10; hole min 0.3, default 0.305, max 6

## Placement (name value [footprint] x y rotation side)
BT1  MY-927-01  [BAT-TH_MY-927-01]  4.83 5.89 270 top
C1  12pF  [C0402]  11.81 18.03 0 top
C2  12pF  [C0402]  28.36 19.05 0 top
C3  12pF  [C0402]  11.81 15.49 0 top
C4  100nF  [C0402]  14.19 19.56 180 top
C5  1uF  [C0402]  16.38 20.16 90 top
C6  12pF  [C0402]  25.62 22.48 0 top
C7  47nF  [C0402]  20.19 19.78 90 top
C8  1uF  [C0402]  21.59 19.78 270 top
C9  4.7uF  [C0402]  13.68 13.59 180 top
C10  100nF  [C0402]  22.99 19.52 90 top
C11  4.7uF  [C0402]  13.68 12.32 180 top
C12  100nF  [C0402]  25.56 17.53 0 top
C13  4.7uF  [C0402]  13.68 11.05 180 top
C14  4.7uF  [C0402]  17.02 10.76 90 top
C15  1pF  [C0402]  25.53 16.13 0 top
C16  100nF  [C0402]  21.08 10.63 90 top
C17  820pF  [C0402]  24.26 12.57 270 top
C18  1.2pF  [C0402]  27.31 14.19 90 top
C19  12pF  [C0402]  31.12 14.01 90 top
C20  1uF  [C0402]  10.88 13.59 0 top
C21  100nF  [C0402]  14.9 9.78 0 top
CN1  1.0-4PWB  [CONN-SMD_4P-P1.00_DEALON_1.0-4PWB]  20.96 3.3 0 top
D1  BZT52C3V3S  [SOD-323_L1.7-W1.3-LS2.6-RD]  9.4 1.14 180 top
L1  15nH  [IND-SMD_L1.0-W0.5-2]  20.7 21.72 0 top
L2  10uH  [IND-SMD_L2.5-W2.0]  18.29 20.57 90 top
L3  4.7nH  [IND-SMD_L1.0-W0.6]  25.45 14.73 0 top
L4  2.2nH  [IND-SMD_L1.0-W0.6]  29.26 14.73 0 top
LED1  NCD0603G1  [LED0603-RD_1]  26.29 3.21 90 top
LED2  NCD0603G1  [LED0603-RD_1]  19.05 9.49 90 top
LED3  VBPW34S  [SENSOR-SMD_L4.4-W3.9]  8.25 18.54 90 top
R1  10kΩ  [R0402]  26.29 5.84 90 top
R2  10kΩ  [R0402]  18.97 11.56 0 top
R3  15kΩ  [R0402]  8.89 13.01 270 top
SW1  TS-1187A-B-A-B  [SW-SMD_4P-L5.1-W5.1-P3.70-LS6.5-TL_H1.5]  13.97 4.83 90 top
U1  nRF52833-QDAA-R  [QFN-40_L5.0-W5.0-P0.40-TL-EP3.6]  20.45 15.37 0 top
U2  -  [TS4231]  10.16 9.78 90 top
X1  32.768kHz  [OSC-SMD_L3.2-W1.5]  14.35 16.77 90 top
X2  32MHz  [CRYSTAL-SMD_4P-L2.0-W1.6-BL-2]  25.59 19.98 270 top

## Footprints (pads in the part's own frame, mm; a bottom-side part is the same pattern mirrored in y, then rotated)
BAT-TH_MY-927-01
  oval 1.3x2.2 hole 0.7x1.6: 1(-4.875,-0.001) 1(4.875,0.001)
  round 6 smd: 2(0,0.001)
C0402
  rect 0.79x0.54 smd: 1(-0.545,0) 2(0.545,0)
CONN-SMD_4P-P1.00_DEALON_1.0-4PWB
  rect 0.7x1.8 smd: 1(-1.5,1.95) 2(-0.5,1.95) 3(0.5,1.95) 4(1.5,1.95)
  rect 1.2x2 smd: 5(2.8,-1.95) 6(-2.8,-1.95)
CRYSTAL-SMD_4P-L2.0-W1.6-BL-2
  rect 1.1x0.8 smd: 1(-0.8,-0.575) 2(0.8,-0.575) 3(0.8,0.575) 4(-0.8,0.575)
IND-SMD_L1.0-W0.5-2
  rect 0.4x0.55 smd: 1(-0.45,0) 2(0.45,0)
IND-SMD_L1.0-W0.6
  rect 0.5x0.648 smd: 1(-0.434,0) 2(0.434,0)
IND-SMD_L2.5-W2.0
  rect 1.2x2.2 smd: 1(1.028,0) 2(-1.028,0)
LED0603-RD_1
  rect 0.8x0.8 smd: 1(-0.799,-0.004) 2(0.799,0.004)
OSC-SMD_L3.2-W1.5
  rect 1.05x1.7 smd: 1(-1.275,0) 2(1.275,0)
QFN-40_L5.0-W5.0-P0.40-TL-EP3.6
  oval 0.8x0.2 smd: 1(-2.499,1.8) 2(-2.499,1.4) 3(-2.499,1) 4(-2.499,0.6) 5(-2.499,0.2) 6(-2.499,-0.2) 7(-2.499,-0.6) 8(-2.499,-1) 9(-2.499,-1.4) 10(-2.499,-1.8) 21(2.499,-1.8) 22(2.499,-1.4) 23(2.499,-1) 24(2.499,-0.6) 25(2.499,-0.2) 26(2.499,0.2) 27(2.499,0.6) 28(2.499,1) 29(2.499,1.4) 30(2.499,1.8)
  oval 0.2x0.8 smd: 11(-1.8,-2.499) 12(-1.4,-2.499) 13(-1,-2.499) 14(-0.6,-2.499) 15(-0.2,-2.499) 16(0.2,-2.499) 17(0.6,-2.499) 18(1,-2.499) 19(1.4,-2.499) 20(1.8,-2.499) 31(1.8,2.499) 32(1.4,2.499) 33(1,2.499) 34(0.6,2.499) 35(0.2,2.499) 36(-0.2,2.499) 37(-0.6,2.499) 38(-1,2.499) 39(-1.4,2.499) 40(-1.8,2.499)
  rect 3.6x3.6 smd: 41(0,0)
R0402
  rect 0.566x0.54 smd: 1(-0.433,0) 2(0.433,0)
SENSOR-SMD_L4.4-W3.9
  rect 1.8x1.8 smd: 1(-3.4,0) 2(3.4,0)
SOD-323_L1.7-W1.3-LS2.6-RD
  rect 0.83x0.63 smd: 1(-1.14,0) 2(1.14,0)
SW-SMD_4P-L5.1-W5.1-P3.70-LS6.5-TL_H1.5
  rect 1x0.75 smd: 1(-3,1.85) 2(3,1.85) 3(-3,-1.85) 4(3,-1.85)
TS4231
  round 0.262 smd: 1(-0.508,0.508) 2(-0.008,0.508) 3(0.492,0.508) 4(-0.508,0.008) 5(-0.008,0.008) 6(0.492,0.008) 7(-0.508,-0.492) 8(-0.008,-0.492) 9(0.492,-0.492)

## Nets
As in the schematic.

Pads without a net: CN1 5 6; SW1 2 3; U1 4 5 12 13 15 17 22 23 31 32 33 34 35 36; X2 2 4

## Via types
v1: diameter 0.61, hole 0.305, Top Layer to Bottom Layer, 20 vias

## Routing (per net, layer and track width the routed paths; a pad name or vN(x,y) marks a point on that pad's centre or on a via; arc(x,y) is an arc through that point)
GND: length 36.9
  Top Layer w0.203: 24.26,12.03 v1(24.26,10.92) ; U1.37 19.85,15.97 v1(20.39,15.42) 20.65,15.17 U1.25 ; U2.5 U2.4 10.15,8.34 7.78,5.97 4.83,5.97 ; C16.1 21.08,8.76 19.79,7.47 18.14,7.47 v1(17.65,6.98) ; C18.1 v1(27.31,12.57) ; LED2.1 17.53,10.21 C14.1 16.58,9.78 C21.2 ; C4.2 13.64,19.99 v1(14.35,20.7) C5.2 19.81,20.7 C7.2 ; C8.2 22.15,19.23 C10.2 v1(22.99,21.21) ; C19.1 v1(31.12,12.06)
VDD_NRF: length 75.9
  Top Layer w0.203: U1.18 21.45,11.54 v1(21.08,11.18) ; C13.1 14.35,11.05 16.87,13.57 U1.10 ; C13.1 C11.1 ; C13.1 14.22,9.89 v1(14.34,9.77) ; U2.8 v1(14.34,9.77) ; v1(14.34,9.77) C21.1 ; v1(22.99,18.98) 22.99,17.21 U1.30 ; C11.1 C9.1 15,14.37 U1.8 ; C11.1 15.87,13.97 U1.9 ; v1(16.38,19.61) 16.38,19.18 17.02,18.54 18.29,18.54 18.65,18.18 U1.40 ; 19.46,5 19.46,4.04 19.94,3.56 22.73,3.56 25.4,6.22 26.24,6.22
  Top Layer w0.381: v1(10.54,2.67) 10.54,1.15 10.54,1.14 ; 19.46,5 19.43,5.02 v1(19.43,6.86)
  Bottom Layer w0.381: v1(19.43,6.86) 16.52,9.77 ; 16.52,9.77 19.68,9.77 v1(21.08,11.18) 22.99,13.08 v1(22.99,18.98) 22.35,19.61 v1(16.38,19.61) ; 16.52,9.77 v1(14.34,9.77) 14.34,6.47 v1(10.54,2.67)
D/CFGDATA: length 10.3
  Top Layer w0.203: v1(10.54,11.43) 10.15,11.04 U2.6 ; U1.7 16.47,14.77 v1(16.26,14.99)
  Bottom Layer w0.203: v1(10.54,11.43) 14.1,14.99 v1(16.26,14.99)
DCC: length 2
  Top Layer w0.203: L2.2 19.05,18.79 U1.39
DEC4: length 15.7
  Top Layer w0.203: v1(22.73,22.22) 21.66,22.22 L1.2 21.59,21.28 C8.1 20.5,19.23 C7.1 19.45,18.48 U1.38 ; v1(24,15.37) 23.8,15.57 U1.26
  Bottom Layer w0.203: v1(24,15.37) 24,21.46 23.24,22.22 v1(22.73,22.22)
E/CFGCLK: length 13.4
  Top Layer w0.203: U2.7 10.65,8.14 v1(10.67,8.13) ; U1.6 17.22,15.17 v1(16.89,15.49)
  Bottom Layer w0.203: v1(16.89,15.49) 16.89,12.45 14.99,10.54 13.84,10.54 11.43,8.13 v1(10.67,8.13)
LED: length 1.5
  Top Layer w0.203: R2.2 19.85,12 U1.14
RESET: length 9.3
  Top Layer w0.203: U1.16 20.65,12.11 20.07,11.53 20.07,8.25 19.64,7.83 SW1.4
SWDCLK: length 8.1
  Top Layer w0.203: 21.46,5.05 21.46,8.13 22.25,8.91 U1.20
SWDIO: length 8.4
  Top Layer w0.203: 20.45,5.08 20.45,7.61 21.85,9.02 21.85,11.56 ; U1.19 21.85,11.56 ; 21.85,11.56 21.84,11.56
XC1: length 7
  Top Layer w0.203: U1.28 23.48,16.37 24.03,16.92 24.03,17.81 24.38,18.16 25.78,18.16 26.16,18.54 26.16,19.18 27.69,19.18 C2.1
XC2: length 6.8
  Top Layer w0.203: C6.1 25.07,20.84 X2.1 24.13,19.89 24.13,18.42 23.67,17.96 23.67,17.07 23.37,16.77 U1.29
XL1: length 6.1
  Top Layer w0.203: U1.2 16.89,16.77 15.61,18.04 X1.2 14.34,18.03 C1.2
XL2: length 6
  Top Layer w0.203: C3.2 X1.1 15.75,15.49 16.62,16.37 U1.3
$1N1552: length 2.6
  Top Layer w0.203: C14.2 17.02,11.94 17.95,12.87 U1.11
$1N2289: length 1.5
  Top Layer w0.203: U1.21 23.81,13.57 C17.1
$1N2530: length 3.5
  Top Layer w0.203: U1.24 24.98,14.77 L3.1 25.02,16.09 C15.1
$1N2985: length 2.9
  Top Layer w0.203: L4.1 C18.2 L3.2
$1N3242: length 18.1
  Top Layer w0.203: L4.2 31.12,14.73
  Top Layer w1.27: 31.12,14.73 34.8,14.73 36.32,13.21 36.32,2.41
$1N3495: length 2.9
  Top Layer w0.203: U1.27 23.7,15.97 24.38,16.65 24.38,16.89 C12.1
$1N6091: length 2
  Top Layer w0.203: L1.1 20.14,21.6 L2.1
$1N9430: length 3.6
  Top Layer w0.203: U2.9 11.43,11.05 11.43,13.59
$1N11204: length 14.8
  Top Layer w0.203: U2.1 8.76,9.27 6.99,11.05 6.99,20.67 8.25,21.94
$1N11226: length 6.5
  Top Layer w0.203: U2.2 9.64,9.78 8.76,9.78 8.25,10.29 LED3.1
$1N11357: length 2.6
  Top Layer w0.203: U2.3 9.65,11.81 R3.2
$1N20837: length 13.1
  Top Layer w0.381: v1(7.24,1.14) D1.2
  Bottom Layer w0.381: v1(7.24,1.14) 4.88,1.14 4.83,1.09
  Bottom Layer w1.016: 4.83,1.09 4.83,10.72
$1N22902: length 1.5
  Top Layer w0.203: R2.1 18.54,10.8 LED2.2
$1N23087: length 4.2
  Top Layer w0.203: U1.1 17.25,17.17 14.86,19.56 C4.1
$1N23686: length 1.4
  Top Layer w0.203: R1.1 26.29,4.02 LED1.2

## Copper pours and planes (outline as drawn; the poured copper is in the pictures)
GND on Top Layer: -1.78,24.89 40.13,24.89 40.13,-3.17 -1.78,-3.17
GND on Bottom Layer: -1.14,25.53 39.24,25.53 39.24,-2.29 -1.14,-2.29

# Board PCB18_1
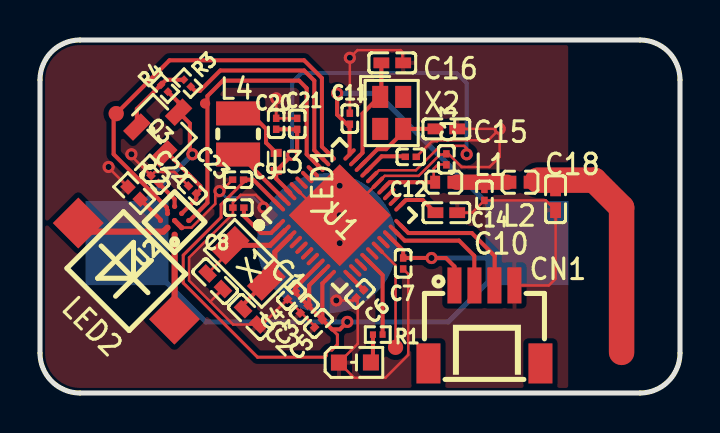
[diagram p4: board, top side]
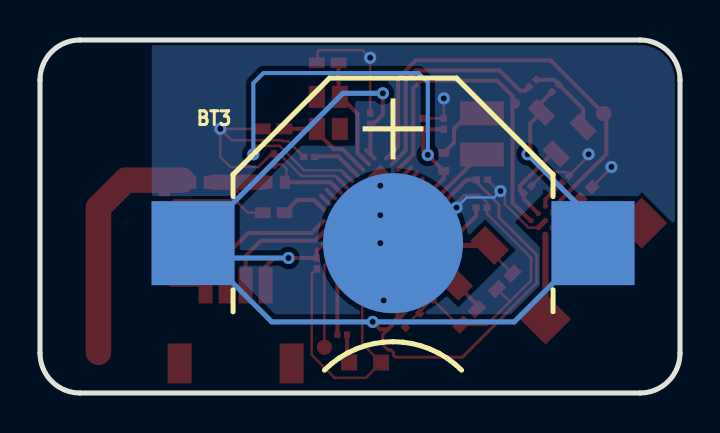
[diagram p5: board, bottom side, seen from below]

Outline 32 x 17.65 mm; copper layers: Top Layer, Bottom Layer. Coordinates in mm from the lower left corner of the outline.
Outline path: 0,15.65 0,2 arc(0.59,0.59) 2,0 30,0 arc(31.42,0.59) 32,2 32,15.65 arc(31.42,17.07) 30,17.65 2,17.65 arc(0.59,17.07) 0,15.65
Stack: Top Layer 0.035mm / Dielectric1 1.51mm FR4 er 4.5 / Bottom Layer 0.035mm

## Design rules (mm)
template: 用户自定义配置
spacing safeClearance (default): track to track 0.152, other pairs 0.152 to 0.3
track width trackWidth (default): min 0.127, default 0.203, max 1.27
differential pair differentialPair (default): width min 0.127, default 0.254, max 2.54; gap min 0.152, default 0.152
via viaSize (default): diameter min 0.5, default 0.61, max 10; hole min 0.3, default 0.305, max 5.999

## Placement (name value [footprint] x y rotation side)
BT3  MY-1632-03  [BAT-SMD_MY-1632-03]  14.35 7.49 180 bottom
C1  12pF  [C0402]  8.76 5.59 135 top
C2  12pF  [C0402]  10.54 3.81 135 top
C3  4.7uF  [C0201]  13.21 4.19 225 top
C4  4.7uF  [C0201]  12.58 4.89 225 top
C5  4.7uF  [C0201]  13.93 3.47 225 top
C6  4.7uF  [C0201]  16 4.95 225 top
C7  100nF  [C0201]  18.16 6.48 90 top
C8  100nF  [C0201]  9.92 9.27 180 top
C9  1uF  [C0201]  9.91 10.67 180 top
C10  820pF  [C0402]  20.32 9.02 0 top
C11  100nF  [C0201]  15.49 13.72 90 top
C12  100nF  [C0201]  18.54 11.81 0 top
C13  1pF  [C0201]  20.32 11.68 90 top
C14  1.2pF  [C0201]  22.22 9.91 90 top
C15  12pF  [C0402]  20.32 13.21 0 top
C16  12pF  [C0402]  17.62 16.51 0 top
C18  12pF  [C0402]  25.78 9.69 90 top
C20  47nF  [C0201]  11.81 13.46 270 top
C21  1uF  [C0201]  12.86 13.46 270 top
C22  1uF  [C0201]  5.74 10.68 135 top
C23  100nF  [C0201]  7.62 10.16 135 top
CN1  1.0-4PWB  [CONN-SMD_4P-P1.00_DEALON_1.0-4PWB]  22.22 3.43 0 top
L1  4.7nH  [IND-SMD_L1.0-W0.6]  20.19 10.54 0 top
L2  2.2nH  [IND-SMD_L1.0-W0.6]  24 10.54 0 top
L3  15nH  [IND-SMD_L1.0-W0.5-2]  11.81 11.56 270 top
L4  10uH  [IND-SMD_L2.5-W2.0]  9.91 12.95 90 top
LED1  NCD0603G1  [LED0603-RD_1]  15.75 1.52 0 top
LED2  VBPW34S  [SENSOR-SMD_L4.4-W3.9]  4.32 6.1 315 top
NOREF  -  [Pad_e642]  3.81 13.97 0 top
NOREF#2  -  [Pad_e1170]  17.78 2.29 0 top
NOREF#3  -  [Pad_e648]  8.25 14.48 0 top
Q3  HL3407A  [SOT-23-3_L2.9-W1.3-P1.90-LS2.4-BL-1]  6.22 13.33 315 top
R1  10kΩ  [R0201]  16.89 2.92 180 top
R2  15kΩ  [R0402]  4.7 10 315 top
R3  1kΩ  [R0201]  7.37 15.49 135 top
R4  1kΩ  [R0201]  6.22 15.24 315 top
U1  nRF52833-QDAA-R  [QFN-40_L5.0-W5.0-P0.40-TL-EP3.6]  14.99 8.89 45 top
U2  -  [TS4231]  6.73 8.64 135 top
X1  32.768kHz  [OSC-SMD_L3.2-W1.5]  10.41 6.48 135 top
X2  32MHz  [CRYSTAL-SMD_4P-L2.0-W1.6-BL-2]  17.59 14.01 270 top

## Footprints (pads in the part's own frame, mm; a bottom-side part is the same pattern mirrored in y, then rotated)
BAT-SMD_MY-1632-03
  rect 4.15x4.2 smd: 1(-10,0) 1(10,0)
  round 7 smd: 2(0,0)
C0201
  rect 0.368x0.324 smd: 1(-0.275,0) 2(0.275,0)
C0402
  rect 0.79x0.54 smd: 1(-0.545,0) 2(0.545,0)
CONN-SMD_4P-P1.00_DEALON_1.0-4PWB
  rect 0.7x1.8 smd: 1(-1.5,1.95) 2(-0.5,1.95) 3(0.5,1.95) 4(1.5,1.95)
  rect 1.2x2 smd: 5(2.8,-1.95) 6(-2.8,-1.95)
CRYSTAL-SMD_4P-L2.0-W1.6-BL-2
  rect 1.1x0.8 smd: 1(-0.8,-0.575) 2(0.8,-0.575) 3(0.8,0.575) 4(-0.8,0.575)
IND-SMD_L1.0-W0.5-2
  rect 0.4x0.55 smd: 1(-0.45,0) 2(0.45,0)
IND-SMD_L1.0-W0.6
  rect 0.5x0.648 smd: 1(-0.434,0) 2(0.434,0)
IND-SMD_L2.5-W2.0
  rect 1.2x2.2 smd: 1(1.028,0) 2(-1.028,0)
LED0603-RD_1
  rect 0.8x0.8 smd: 1(-0.799,-0.004) 2(0.799,0.004)
OSC-SMD_L3.2-W1.5
  rect 1.05x1.7 smd: 1(-1.275,0) 2(1.275,0)
Pad_e642
  round 0.762 smd: 1(0,0)
Pad_e648
  round 0.508 smd: 1(0,0)
Pad_e1170
  round 0.762 smd: 1(0,0)
QFN-40_L5.0-W5.0-P0.40-TL-EP3.6
  oval 0.8x0.2 smd: 1(-2.499,1.8) 2(-2.499,1.4) 3(-2.499,1) 4(-2.499,0.6) 5(-2.499,0.2) 6(-2.499,-0.2) 7(-2.499,-0.6) 8(-2.499,-1) 9(-2.499,-1.4) 10(-2.499,-1.8) 21(2.499,-1.8) 22(2.499,-1.4) 23(2.499,-1) 24(2.499,-0.6) 25(2.499,-0.2) 26(2.499,0.2) 27(2.499,0.6) 28(2.499,1) 29(2.499,1.4) 30(2.499,1.8)
  oval 0.2x0.8 smd: 11(-1.8,-2.499) 12(-1.4,-2.499) 13(-1,-2.499) 14(-0.6,-2.499) 15(-0.2,-2.499) 16(0.2,-2.499) 17(0.6,-2.499) 18(1,-2.499) 19(1.4,-2.499) 20(1.8,-2.499) 31(1.8,2.499) 32(1.4,2.499) 33(1,2.499) 34(0.6,2.499) 35(0.2,2.499) 36(-0.2,2.499) 37(-0.6,2.499) 38(-1,2.499) 39(-1.4,2.499) 40(-1.8,2.499)
  rect 3.6x3.6 smd: 41(0,0)
R0201
  rect 0.303x0.324 smd: 1(-0.241,0) 2(0.241,0)
R0402
  rect 0.566x0.54 smd: 1(-0.433,0) 2(0.433,0)
SENSOR-SMD_L4.4-W3.9
  rect 1.8x1.8 smd: 1(-3.4,0) 2(3.4,0)
SOT-23-3_L2.9-W1.3-P1.90-LS2.4-BL-1
  rect 0.7x1.25 smd: 1(-0.95,-1) 2(0.95,-1) 3(0,1)
TS4231
  round 0.262 smd: 1(-0.508,0.508) 2(-0.008,0.508) 3(0.492,0.508) 4(-0.508,0.008) 5(-0.008,0.008) 6(0.492,0.008) 7(-0.508,-0.492) 8(-0.008,-0.492) 9(0.492,-0.492)

## Nets
As in the schematic, except:
D/CFGDATA: NOREF.1 U1.31 U2.6
E/CFGCLK: NOREF#3.1 U1.33 U2.7
RESET: NOREF#2.1 U1.16

Pads without a net: CN1 5 6; U1 4 5 6 7 12 13 15 17 22 23 34 35 36; X2 2 4

## Via types
v1: diameter 0.61, hole 0.305, Top Layer to Bottom Layer, 17 vias

## Routing (per net, layer and track width the routed paths; a pad name or vN(x,y) marks a point on that pad's centre or on a via; arc(x,y) is an arc through that point)
GND: length 81.4
  Top Layer w0.127: C11.2 v1(15.49,16.76) 15.88,17.14 18.03,17.14 18.12,17.05 18.12,16.55 C16.2 ; v1(22.99,13.21) C15.2 ; v1(22.99,13.21) 22.42,12.64 19.9,12.64 19.86,12.59 19.6,12.59 C12.2 ; v1(22.99,13.21) 22.99,11.81 22.48,11.3 21.08,11.3 20.43,11.96 C13.2 20.19,11.96 20.16,11.92 20,11.92 18.94,10.86 17.24,10.86 U1.25 15.27,8.89 v1(14.99,8.89) 14.14,8.89 U1.37 ; v1(4.57,11.94) 4.57,11.85 C22.2 5.73,11.05 6.73,11.05 C23.2 ; 8.51,4.57 7.45,5.63 7.45,6.77 9.65,8.96 C8.2 9.65,9.52 10.03,9.91 10.79,9.91 11.18,9.52 v1(11.18,9.27) ; 8.51,4.57 8.51,4.57 C1.1 ; 8.51,4.57 9.66,3.42 C2.1 11.11,3.42 C4.2 13.73,3.34 C5.2 ; v1(11.81,14.73) C20.1 12.86,13.74 C21.1 ; CN1.4 25.44,5.38 25.78,5.71 C18.1 25.29,9.63 C14.1 21.61,9.02 C10.2 ; v1(3.43,11.3) 3.43,11.27 R2.1 ; U2.4 7.58,8.27 8.76,9.46 8.76,9.88 v1(8.98,10.1) 9.06,10.1 C9.2 ; v1(14.82,4.63) 15.68,4.63 15.81,4.76 15.89,4.68 15.89,2.46 LED1.1 15.71,0.76 17.27,0.76 18.41,1.91 18.41,5.95 C7.1
  Top Layer w0.254: U2.4 U2.5
  Bottom Layer w0.127: v1(8.98,10.1) 9.3,9.78 10.67,9.78 v1(11.18,9.27)
  vias: v1(14.99,10.36) v1(14.99,7.49)
VDD_NRF: length 86.8
  Top Layer w0.152: C9.1 10.18,10.55 9.05,9.42 9.05,8.78 7.16,6.89 7.16,5.5 10.88,1.79 14.24,1.79 14.32,1.87 14.32,2.02 14.45,2.15 14.59,2.15 14.87,2.42 14.87,2.92 14.6,3.18
  Top Layer w0.203: R4.2 6.93,14.53 6.93,14.04 7.49,13.48 7.49,12.06 v1(7.62,11.94) ; 14.49,5.85 14.12,5.48 C5.1 ; v1(15.37,3.56) 14.99,3.18 14.6,3.18 C5.1 ; 13.4,4.38 12.77,5.02 C4.1 12.77,5.26 U1.8 ; 13.4,4.38 13.46,4.44 13.46,5.39 U1.9 ; 13.4,4.38 C5.1 ; U1.30 15.48,13.43 C11.1 15.34,13.44 14.86,13.92 v1(14.86,14.99) ; 17.46,7.83 18.16,7.13 C7.2 v1(19.58,6.75) 20.3,6.75 20.72,6.33 CN1.1 ; C9.1 10.66,10.67 U1.40
  Bottom Layer w0.254: v1(7.62,11.94) 4.35,8.67 BT3.1 8.29,3.56 v1(15.37,3.56) 20.41,3.56 23.61,6.75 ; 23.61,6.75 BT3.1 16.86,14.99 v1(14.86,14.99) ; 23.61,6.75 v1(19.58,6.75)
D/CFGDATA: length 21.9
  Top Layer w0.203: U2.6 6.38,9.14 6.35,9.17 6.35,9.27 3.68,11.94 3.68,13.84 6.48,16.64 13.21,16.64 14.1,15.75 14.1,12.32 14.49,11.93 U1.31
DCC: length 3.1
  Top Layer w0.203: U1.39 10.35,11.54 9.91,11.54
DEC4: length 27
  Top Layer w0.127: 16.61,10.8 16.95,11.14 18.79,11.14 20.02,12.36 21.21,12.36 21.34,12.23 v1(21.34,11.94)
  Top Layer w0.203: U1.38 12.51,10.02 11.81,10.72 L3.2 v1(12.61,11.91) 12.86,12.15 12.86,13.19 ; 12.86,13.19 C20.2 ; 12.86,13.19 C21.2
  Bottom Layer w0.203: v1(12.61,11.91) 12.61,15.53 13.08,16 20.83,16 21.34,15.49 v1(21.34,11.94)
E/CFGCLK: length 16.2
  Top Layer w0.203: 7.44,8.62 7.48,8.62 8.37,9.52 8.37,14.85 9.14,15.62 12.95,15.62 13.33,15.24 13.33,11.94 13.91,11.36 U1.33
LED: length 4.1
  Top Layer w0.203: U1.14 17.13,5.89 R1.1
POWER_TS4231: length 11.1
  Top Layer w0.203: U1.32 13.72,12.14 13.72,15.62 13.21,16.13 9.02,16.13 8,15.11 7.75,15.11 R3.1
RESET: length 5.4
  Top Layer w0.127: 17.65,2.29 17.78,2.41 17.78,6.38 16.89,7.26
SWDCLK: length 6.8
  Top Layer w0.203: 18.03,8.4 18.42,8 21.59,8 22.73,6.86 22.73,5.39 CN1.3
SWDIO: length 6
  Top Layer w0.203: U1.19 18.24,7.62 20.95,7.62 21.72,6.86 21.72,5.39 CN1.2
XC1: length 4.6
  Top Layer w0.203: C15.1 X2.3 18.23,13.14 18.23,13.12 17.3,12.19 16.87,12.19 16.05,11.36
XC2: length 5.4
  Top Layer w0.203: U1.29 16.13,12.01 16.13,13.97 16.97,14.81 X2.1 17.07,14.87 C16.1
XL1: length 4.9
  Top Layer w0.127: X1.2 9.51,7.11 C1.2
  Top Layer w0.254: X1.2 11.5,7.38 U1.2
XL2: length 4.6
  Top Layer w0.203: C2.2 10.16,4.42 X1.1
  Top Layer w0.254: 12.52,7.83 11.74,7.05 11.74,6.01 X1.1
$1N2289: length 2.1
  Top Layer w0.203: C10.1 19.14,9.65 18.29,9.65 18.03,9.38
$1N2530: length 3.9
  Top Layer w0.127: 19.69,10.79 19.69,11.21 19.9,11.43 20.3,11.43 C13.1
  Top Layer w0.203: U1.24 17.49,10.54 L1.1
$1N2985: length 2.5
  Top Layer w0.762: 20.83,10.54 23.37,10.54
$1N3242: length 12
  Top Layer w1.27: 24.89,10.64 27.71,10.64 29.08,9.27 29.08,2.03
$1N3495: length 2.2
  Top Layer w0.203: U1.27 16.34,11.09 arc(16.35,11.1) 16.36,11.11 17.09,11.84 18.24,11.84
$1N6091: length 3
  Top Layer w0.203: L3.1 11.3,12.52 11.3,13.21 10.91,13.6 9.91,13.6
$1N9430: length 1.5
  Top Layer w0.203: U2.9 6.73,9.69 C22.1
$1N11204: length 4.2
  Top Layer w0.305: 6.72,3.69 6.73,3.7 U2.1
$1N11226: length 4.7
  Top Layer w0.305: U2.2 6.17,8.07 2.35,8.07 1.91,8.5
$1N11357: length 1.5
  Top Layer w0.203: 5.01,9.69 6.02,8.68 6.02,8.62
$1N22902: length 1.2
  Top Layer w0.203: 16.63,1.69 16.65,1.7 R1.2
$1N23087: length 2.7
  Top Layer w0.203: U1.1 11.55,8 11.05,8 10.2,8.85 C8.1
$1N28962: length 4.3
  Top Layer w0.203: 6.19,11.96 6.41,11.96 8.02,10.35 8.02,10.17 7.81,9.97 7.81,9.71 U2.8
$1N29852: length 1
  Top Layer w0.203: C6.1 15.49,5.85 15.48,5.85
$1N31595: length 3.9
  Top Layer w0.203: Q3.1 4.84,14.2 R4.1 6.31,15.66 R3.2

## Copper pours and planes (outline as drawn; the poured copper is in the pictures)
GND on Top Layer: -3.94,20.83 34.8,20.83 34.8,-1.78 -3.94,-1.78
GND on Bottom Layer: -6.99,24.13 38.73,24.13 38.73,-5.21 -6.99,-5.21
